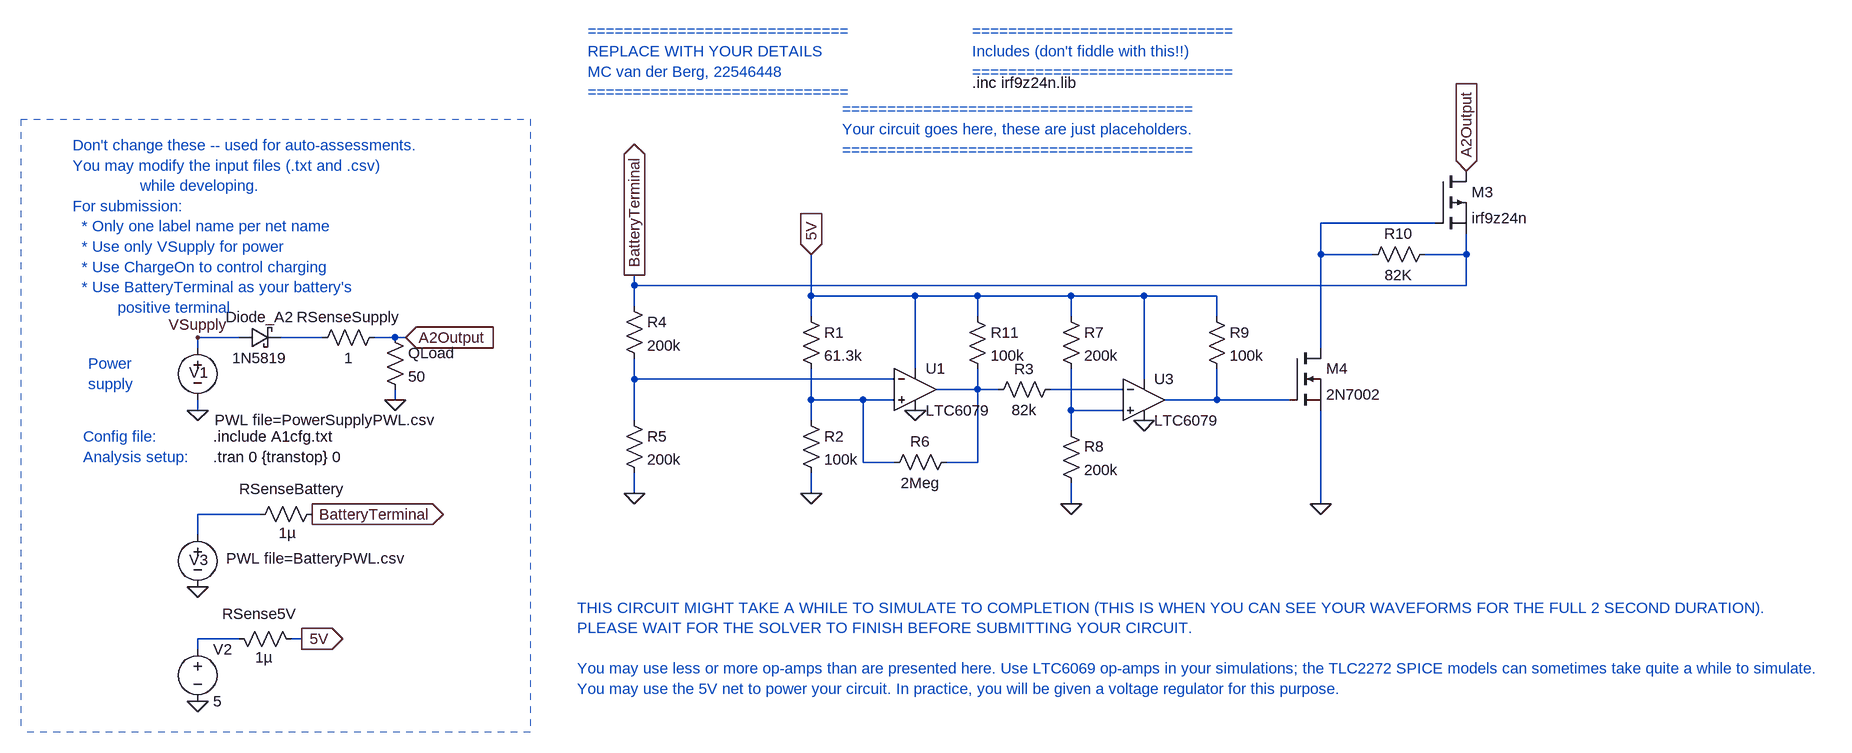
[diagram p0: schematic E344_22546448_A3.asc]
E344_22546448_A3.asc, the LTspice schematic file:
Version 4
SHEET 1 1824 680
WIRE -192 -1264 -368 -1264
WIRE -368 -1216 -368 -1264
WIRE -288 -1216 -368 -1216
WIRE -144 -1216 -144 -1248
WIRE -144 -1216 -208 -1216
WIRE -1424 -1168 -1424 -1184
WIRE -144 -1168 -144 -1216
WIRE -144 -1168 -1424 -1168
WIRE -1152 -1152 -1152 -1216
WIRE -992 -1152 -1152 -1152
WIRE -896 -1152 -992 -1152
WIRE -752 -1152 -896 -1152
WIRE -640 -1152 -752 -1152
WIRE -528 -1152 -640 -1152
WIRE -1424 -1136 -1424 -1168
WIRE -1152 -1120 -1152 -1152
WIRE -896 -1120 -896 -1152
WIRE -752 -1120 -752 -1152
WIRE -528 -1120 -528 -1152
WIRE -2032 -1088 -2096 -1088
WIRE -1904 -1088 -1968 -1088
WIRE -1792 -1088 -1824 -1088
WIRE -1776 -1088 -1792 -1088
WIRE -2096 -1072 -2096 -1088
WIRE -368 -1072 -368 -1216
WIRE -992 -1040 -992 -1152
WIRE -1424 -1024 -1424 -1056
WIRE -1024 -1024 -1424 -1024
WIRE -640 -1024 -640 -1152
WIRE -896 -1008 -896 -1040
WIRE -896 -1008 -960 -1008
WIRE -864 -1008 -896 -1008
WIRE -672 -1008 -784 -1008
WIRE -1792 -992 -1792 -1008
WIRE -1152 -992 -1152 -1040
WIRE -1072 -992 -1152 -992
WIRE -1024 -992 -1072 -992
WIRE -528 -992 -528 -1040
WIRE -528 -992 -608 -992
WIRE -416 -992 -528 -992
WIRE -2096 -976 -2096 -992
WIRE -752 -976 -752 -1040
WIRE -672 -976 -752 -976
WIRE -1424 -960 -1424 -1024
WIRE -1152 -960 -1152 -992
WIRE -752 -944 -752 -976
WIRE -1072 -896 -1072 -992
WIRE -1024 -896 -1072 -896
WIRE -896 -896 -896 -1008
WIRE -896 -896 -944 -896
WIRE -1424 -848 -1424 -880
WIRE -1152 -848 -1152 -880
WIRE -752 -832 -752 -864
WIRE -368 -832 -368 -976
WIRE -2000 -816 -2096 -816
WIRE -2096 -784 -2096 -816
WIRE -2032 -624 -2096 -624
WIRE -1936 -624 -1952 -624
WIRE -2096 -608 -2096 -624
FLAG -2096 -976 0
FLAG -1776 -1088 A2Output
IOPIN -1776 -1088 In
FLAG -1920 -816 BatteryTerminal
IOPIN -1920 -816 Out
FLAG -2096 -704 0
FLAG -1936 -624 5V
IOPIN -1936 -624 Out
FLAG -2096 -1088 VSupply
FLAG -1792 -992 0
FLAG -2096 -528 0
FLAG -1424 -1184 BatteryTerminal
IOPIN -1424 -1184 Out
FLAG -144 -1344 A2Output
IOPIN -144 -1344 In
FLAG -1152 -1216 5V
IOPIN -1152 -1216 In
FLAG -1152 -848 0
FLAG -992 -976 0
FLAG -640 -960 0
FLAG -1424 -848 0
FLAG -752 -832 0
FLAG -368 -832 0
SYMBOL voltage -2096 -1088 R0
WINDOW 123 0 0 Left 0
WINDOW 39 0 0 Left 0
WINDOW 3 26 127 Left 2
WINDOW 0 -13 54 Left 2
SYMATTR Value PWL file=PowerSupplyPWL.csv
SYMATTR InstName V1
SYMBOL res -1904 -832 R90
WINDOW 0 -7 47 VBottom 2
WINDOW 3 29 54 VTop 2
SYMATTR InstName RSenseBattery
SYMATTR Value 1µ
SYMBOL schottky -2032 -1072 R270
WINDOW 0 32 32 VTop 2
WINDOW 3 0 32 VBottom 2
SYMATTR InstName Diode_A2
SYMATTR Value 1N5819
SYMATTR Description Diode
SYMATTR Type diode
SYMBOL voltage -2096 -800 R0
WINDOW 123 0 0 Left 0
WINDOW 39 0 0 Left 0
WINDOW 3 44 52 Left 2
WINDOW 0 -13 54 Left 2
SYMATTR Value PWL file=BatteryPWL.csv
SYMATTR InstName V3
SYMBOL res -1920 -1072 R270
WINDOW 0 32 56 VTop 2
WINDOW 3 0 56 VBottom 2
SYMATTR InstName RSenseSupply
SYMATTR Value 1
SYMBOL res -1808 -1104 R0
SYMATTR InstName QLoad
SYMATTR Value 50
SYMBOL voltage -2096 -624 R0
WINDOW 123 0 0 Left 0
WINDOW 39 0 0 Left 0
SYMATTR InstName V2
SYMATTR Value 5
SYMBOL res -2048 -640 M90
WINDOW 0 -7 47 VBottom 2
WINDOW 3 29 54 VTop 2
SYMATTR InstName RSense5V
SYMATTR Value 1µ
SYMBOL pmos -192 -1344 R0
SYMATTR InstName M3
SYMATTR Value irf9z24n
SYMATTR Prefix X
SYMATTR SpiceModel irf9z24n
SYMBOL nmos -416 -1072 R0
SYMATTR InstName M4
SYMATTR Value 2N7002
SYMBOL OpAmps\\LTC6079 -992 -1008 R0
SYMATTR InstName U1
SYMBOL OpAmps\\LTC6079 -640 -992 R0
SYMATTR InstName U3
SYMBOL res -1168 -1136 R0
SYMATTR InstName R1
SYMATTR Value 61.3k
SYMBOL res -1168 -976 R0
SYMATTR InstName R2
SYMATTR Value 100k
SYMBOL res -768 -1024 R90
WINDOW 0 0 56 VBottom 2
WINDOW 3 32 56 VTop 2
SYMATTR InstName R3
SYMATTR Value 82k
SYMBOL res -1440 -1152 R0
SYMATTR InstName R4
SYMATTR Value 200k
SYMBOL res -1440 -976 R0
SYMATTR InstName R5
SYMATTR Value 200k
SYMBOL res -928 -912 R90
WINDOW 0 0 56 VBottom 2
WINDOW 3 32 56 VTop 2
SYMATTR InstName R6
SYMATTR Value 2Meg
SYMBOL res -768 -1136 R0
SYMATTR InstName R7
SYMATTR Value 200k
SYMBOL res -768 -960 R0
SYMATTR InstName R8
SYMATTR Value 200k
SYMBOL res -192 -1232 R90
WINDOW 0 0 56 VBottom 2
WINDOW 3 32 56 VTop 2
SYMATTR InstName R10
SYMATTR Value 82K
SYMBOL res -912 -1136 R0
SYMATTR InstName R11
SYMATTR Value 100k
SYMBOL res -544 -1136 R0
SYMATTR InstName R9
SYMATTR Value 100k
TEXT -2072 -904 Left 2 !.tran 0 {transtop} 0
TEXT -2072 -936 Left 2 !.include A1cfg.txt
TEXT -2288 -1384 Left 2 ;Don't change these -- used for auto-assessments.\nYou may modify the input files (.txt and .csv) \n               while developing.\nFor submission: \n  * Only one label name per net name\n  * Use only VSupply for power\n  * Use ChargeOn to control charging\n  * Use BatteryTerminal as your battery's \n          positive terminal
TEXT -2272 -936 Left 2 ;Config file:
TEXT -2272 -904 Left 2 ;Analysis setup:
TEXT -2264 -1048 Left 2 ;Power\nsupply
TEXT -1496 -1560 Left 2 ;=============================\nREPLACE WITH YOUR DETAILS\nMC van der Berg, 22546448\n=============================
TEXT -904 -1480 Left 2 !.inc irf9z24n.lib
TEXT -904 -1560 Left 2 ;=============================\nIncludes (don't fiddle with this!!)\n=============================
TEXT -1104 -1440 Left 2 ;=======================================\nYour circuit goes here, these are just placeholders.\n=======================================
TEXT -1512 -672 Left 2 ;THIS CIRCUIT MIGHT TAKE A WHILE TO SIMULATE TO COMPLETION (THIS IS WHEN YOU CAN SEE YOUR WAVEFORMS FOR THE FULL 2 SECOND DURATION).\nPLEASE WAIT FOR THE SOLVER TO FINISH BEFORE SUBMITTING YOUR CIRCUIT.\n \nYou may use less or more op-amps than are presented here. Use LTC6069 op-amps in your simulations; the TLC2272 SPICE models can sometimes take quite a while to simulate.\nYou may use the 5V net to power your circuit. In practice, you will be given a voltage regulator for this purpose.
LINE Normal -1584 -1424 -1584 -480 2
LINE Normal -2368 -1424 -1584 -1424 2
LINE Normal -1584 -480 -2368 -480 2
LINE Normal -1584 -496 -1584 -496 2
LINE Normal -2368 -1424 -2368 -480 2

The netlist it stands for:
* E344_22546448_A3.asc
V1 VSupply 0 PWL file=PowerSupplyPWL.csv
RSenseBattery BatteryTerminal N009 1µ
Diode_A2 VSupply N002 1N5819
V3 N009 0 PWL file=BatteryPWL.csv
RSenseSupply N002 A2Output 1
R§QLoad A2Output 0 50
V2 N010 0 5
RSense5V N010 5V 1µ
XM3 A2Output N001 BatteryTerminal irf9z24n irf9z24n  ; pins D G S
M4 N001 N007 0 0 2N7002
XU1 N006 N003 5V 0 N004 LTC6078  ; LTC6079, pins In+ In- V+ V- OUT
XU3 N008 N005 5V 0 N007 LTC6078  ; LTC6079, pins In+ In- V+ V- OUT
R1 5V N006 61.3k
R2 N006 0 100k
R3 N005 N004 82k
R4 BatteryTerminal N003 200k
R5 N003 0 200k
R6 N004 N006 2Meg
R7 5V N008 200k
R8 N008 0 200k
R10 BatteryTerminal N001 82K
R11 5V N004 100k
R9 5V N007 100k
.model D D
.lib standard.dio
.model NMOS NMOS
.model PMOS PMOS
.lib standard.mos
.tran 0 {transtop} 0
.include A1cfg.txt
* Don't change these -- used for auto-assessments.
* You may modify the input files (.txt and .csv)
*                while developing.
* For submission:
*   * Only one label name per net name
*   * Use only VSupply for power
*   * Use ChargeOn to control charging
*   * Use BatteryTerminal as your battery's
*           positive terminal
* Config file:
* Analysis setup:
* Power
* supply
* =============================
* REPLACE WITH YOUR DETAILS
* MC van der Berg, 22546448
* =============================
.inc irf9z24n.lib
* =============================
* Includes (don't fiddle with this!!)
* =============================
* =======================================
* Your circuit goes here, these are just placeholders.
* =======================================
* THIS CIRCUIT MIGHT TAKE A WHILE TO SIMULATE TO COMPLETION (THIS IS WHEN YOU CAN SEE YOUR WAVEFORMS FOR THE FULL 2 SECOND DURATION).
* PLEASE WAIT FOR THE SOLVER TO FINISH BEFORE SUBMITTING YOUR CIRCUIT.
* You may use less or more op-amps than are presented here. Use LTC6069 op-amps in your simulations; the TLC2272 SPICE models can sometimes take quite a while to simulate.
* You may use the 5V net to power your circuit. In practice, you will be given a voltage regulator for this purpose.
.lib LTC5.lib
.backanno
.end

* Results of the author's LTspice run, read from the files saved beside the schematic
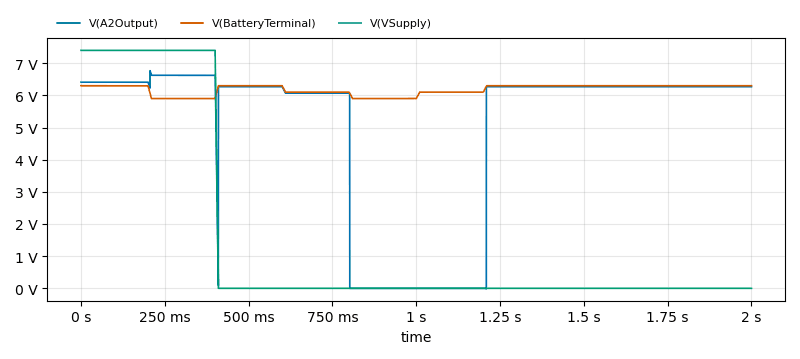
[diagram p1: Transient Analysis of E344_22546448_A3.asc, plotted from the saved traces]
* Transient Analysis, 1 run:
*   V(A2Output): min -15.41 mV, max 6.768 V, average 5.008 V, rms 5.619 V, last 6.27 V
*   V(BatteryTerminal): min 5.9 V, max 6.3 V, average 6.18 V, rms 6.182 V, last 6.3 V
*   V(VSupply): min 0 V, max 7.4 V, average 1.498 V, rms 3.323 V, last 0 V